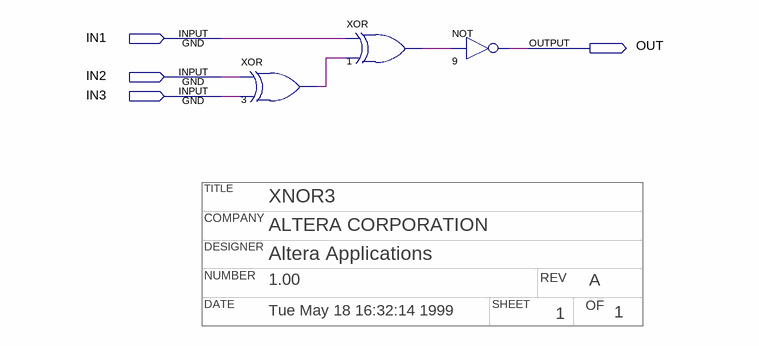
[diagram p0: schematic sheet]
// Quartus schematic xnor3.bdf as structural Verilog: 3 symbols, 4 pins
// Title block: TITLE: XNOR3; COMPANY: ALTERA CORPORATION; DESIGNER: Altera Applications; NUMBER: 1.00; REV: A; DATE: Tue May 18 16:32:14 1999; SHEET: 1; OF: 1
module xnor3 (
  input  IN1,
  input  IN2,
  input  IN3,
  output OUT
);

  wire n1_out, n3_out;

  xor u_3 (n3_out, IN2, IN3);
  xor u_1 (n1_out, IN1, n3_out);
  not u_9 (OUT, n1_out);
endmodule
